# Altium schematic sheet 09 - Controlled Power.SchDoc: Controlled Power - 25kW WolfPACK 6-pack Inverter
size 431 x 279 mm; Date: 09/2024; DocumentNumber: CRD25DA12N-FMC; Revision: 2.0; SheetNumber: 9; SheetTotal: 9; SheetSize: B
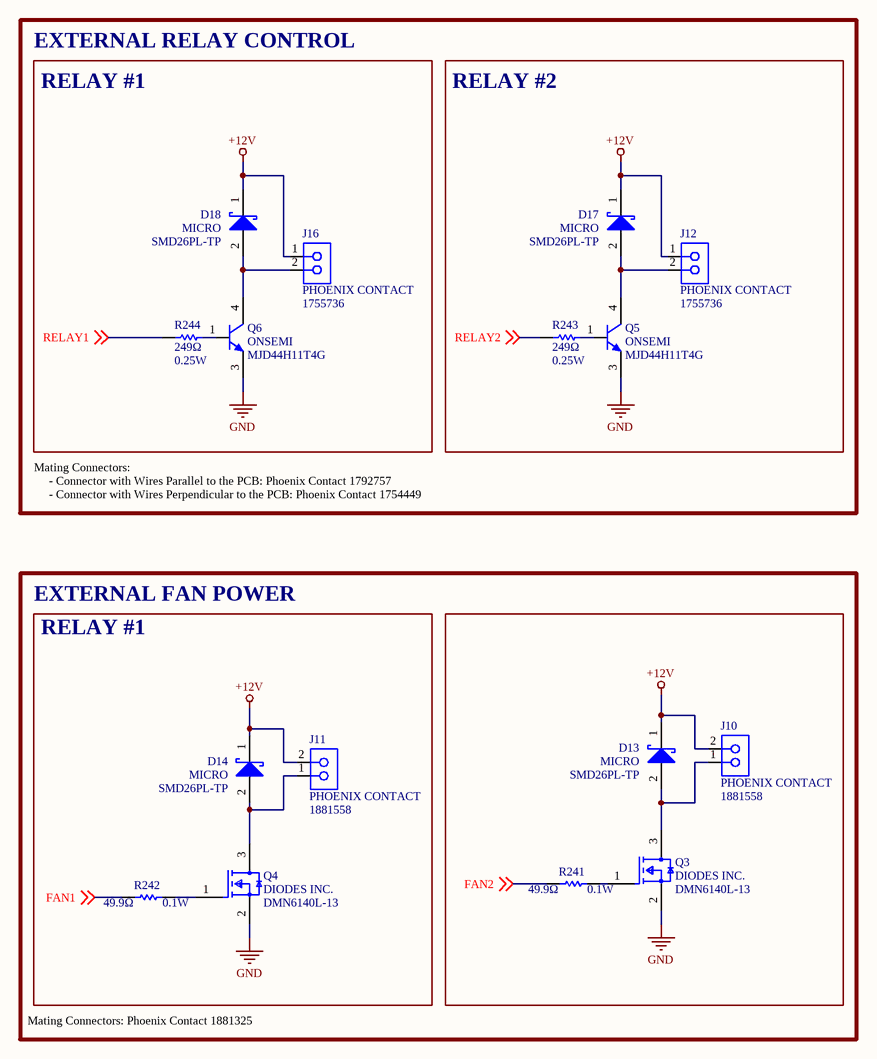
[diagram p0: 09 - Controlled Power.SchDoc]

## Parts
D13  SMD26PL-TP  Manufacturer: MICRO  [ONSC-SOD-123FL-2-498-01_V]
D14  SMD26PL-TP  Manufacturer: MICRO  [ONSC-SOD-123FL-2-498-01_V]
D17  SMD26PL-TP  Manufacturer: MICRO  [ONSC-SOD-123FL-2-498-01_V]
D18  SMD26PL-TP  Manufacturer: MICRO  [ONSC-SOD-123FL-2-498-01_V]
J10  Manufacturer: PHOENIX CONTACT  [CONN_1881558]  (hidden comment: 1881558)
J11  Manufacturer: PHOENIX CONTACT  [CONN_1881558]  (hidden comment: 1881558)
J12  Manufacturer: PHOENIX CONTACT  [1755736]  (hidden comment: 1755736)
J16  Manufacturer: PHOENIX CONTACT  [1755736]  (hidden comment: 1755736)
Q3  DMN6140L-13  Manufacturer: DIODES INC.  [FP-SOT23-MFG]
Q4  DMN6140L-13  Manufacturer: DIODES INC.  [FP-SOT23-MFG]
Q5  Manufacturer: ONSEMI  [ONSC-DPAK-3-369C-01_V]  (hidden comment: MJD44H11T4G)
Q6  Manufacturer: ONSEMI  [ONSC-DPAK-3-369C-01_V]  (hidden comment: MJD44H11T4G)
R241  Resistance: 49.9Ω  Power Rating: 0.1W  [FP-MCR03-IPC_B]  (hidden comment: ERJ-3EKF49R9V)
R242  Resistance: 49.9Ω  Power Rating: 0.1W  [FP-MCR03-IPC_B]  (hidden comment: ERJ-3EKF49R9V)
R243  Resistance: 249Ω  Power Rating: 0.25W  [FP-MCR18-IPC_A]  (hidden comment: RC1206FR-07249RL)
R244  Resistance: 249Ω  Power Rating: 0.25W  [FP-MCR18-IPC_A]  (hidden comment: RC1206FR-07249RL)

## Blocks framed on the sheet
RELAY #2: D17 J12 Q5 R243

## Nets
+12V: D13.1(K) D14.1(K) D17.1(K) D18.1(K) J10.2 J11.2 J12.1 J16.1
GND: Q3.2(S) Q4.2(S) Q5.3(E) Q6.3(E)
FAN1: R242.1 ; off-sheet FAN1
FAN2: R241.1 ; off-sheet FAN2
RELAY1: R244.1 ; off-sheet RELAY1
RELAY2: R243.1 ; off-sheet RELAY2
NetD13_2: D13.2(A) J10.1 Q3.3(D)
NetD14_2: D14.2(A) J11.1 Q4.3(D)
NetD17_2: D17.2(A) J12.2 Q5.4(C)
NetD18_2: D18.2(A) J16.2 Q6.4(C)
NetQ3_1: Q3.1(G) R241.2
NetQ4_1: Q4.1(G) R242.2
NetQ5_1: Q5.1(B) R243.2
NetQ6_1: Q6.1(B) R244.2

## Notes on the sheet
- EXTERNAL RELAY CONTROL
- RELAY #1
- Mating Connectors:
  - Connector with Wires Parallel to the PCB: Phoenix Contact 1792757
  - Connector with Wires Perpendicular to the PCB: Phoenix Contact 1754449
- EXTERNAL FAN POWER
- Mating Connectors: Phoenix Contact 1881325
- Title:
- Date:
- Drawing No:
- Size:
- B
- Revision:
- Sheet:
- of

## Library data of the parts
D13 D14 D17 D18 = SMD26PL-TP: DIODE SCHOTTKY 60V 2A SOD123FL; Forward Voltage: 700mV; Max Reverse Current: 500uA; Max Surge Current: 50A; Max Power Dissipation: 1.68W; Supplier 1: Digi-Key; Manufacturer Part Number: SMD26PL-TP; RoHS: Yes; Category: Rectifier Diodes; Stock 1: 317348; Pricing 1: 1=0.40000, 10=0.30200, 100=0.18790, 500=0.12854, 1000=0.09888 (USD); Mount: Surface Mount; Number of Pins: 2; Min Operating Temperature: -65°C; Max Operating Temperature: 125°C; Packaging: Tape and Reel; Package Quantity: 1; Average Rectified Current: 2A; Max Repetitive Reverse Voltage (Vrrm): 60V; Max Reverse Voltage (DC): 60V; Lead Free: Lead Free; RoHS Compliant: Yes; ComponentLink1URL: https://datasheet.ciiva.com/4717/smd22pl-smd210plsod-123fl-27814-4717414.pdf?src-supplier=Mouser; ComponentLink1Description: https://datasheet.ciiva.com/4717/smd22pl-smd210plsod-123fl-27814-4717414.pdf?src-supplier=Mouser; ComponentLink2URL: https://datasheet.ciiva.com/17444/smd22pl-smd210plsod-123fl-17444944.pdf?src-supplier=Future+Electronics; ComponentLink2Description: https://datasheet.ciiva.com/17444/smd22pl-smd210plsod-123fl-17444944.pdf?src-supplier=Future+Electronics; ComponentLink3URL: https://datasheet.ciiva.com/917/smd22pl-smd210plsod-123fl-917242.pdf?src-supplier=Digi-Key; ComponentLink3Description: https://datasheet.ciiva.com/917/smd22pl-smd210plsod-123fl-917242.pdf?src-supplier=Digi-Key; ComponentLink4URL: https://datasheet.ciiva.com/917/smd22pl-smd210plsod-123fl-917243.pdf?src-supplier=Digi-Key; ComponentLink4Description: https://datasheet.ciiva.com/917/smd22pl-smd210plsod-123fl-917243.pdf?src-supplier=Digi-Key; ComponentLink5URL: https://datasheet.ciiva.com/917/smd22pl-smd210plsod-123fl-917244.pdf?src-supplier=Digi-Key; ComponentLink5Description: https://datasheet.ciiva.com/917/smd22pl-smd210plsod-123fl-917244.pdf?src-supplier=Digi-Key; Supplier Part Number 1: SMD26PL-TPMSCT-ND; Package: SOD-123F; Value: N/A
J10 J11 = 1881558: TERM BLOCK HDR 2POS VERT 2.5MM; Manufacturer Part Number: 1881558; Package: N/A; Value: N/A
J12 J16 = 1755736: TERM BLOCK HDR 2POS VERT 5.08MM; Content: 250pc(s); Industrial packaging: Yes; Number of contacts: 2; Manufacturer URL: http://www.phoenixcontact.com/; Datasheet Version: Apr-16; Pitch: 5.08mm; Datasheet URL: http://www.mouser.com/ds/2/324/ItemDetail_1755736-921028.pdf; Manufacturer Part Number: 1755736; Type: MSTBVA2,5/2-G-5,08; Colour: Green; Supplier 1: Rs; Supplier Part Number 1: 1896199; Value: N/A; Package: N/A
Q3 Q4 = CMP-12801-000047-1: MOSFET N-CH 60V 1.6A SOT23; Turn Off Delay Time: 16.3ns; Power Dissipation: 0.7W; Pulse Drain Current: 10A; Number Of Channels: 1; Reverse Recovery Time: 16.8ns; Typ Forward Diode Voltage: 0.75V; Gate To Source Voltage: 20V; Rthja Max: 183°C/W; Gate Charge At Vgs: 8.6nC @ 10V; Drain To Source Resistance: 92mΩ; Depletion Mode: False; Max Junction Temp: +150°C; Max Forward Diode Voltage: 1V; Reverse Recovery Charge: 9nC; Input Capacitace At Vds: 315pF @ 40V; Standoff Height: 0.013mm; Threshold Vgs Max: 3V; Turn On Delay Time: 2.6ns; Mouser Description: MOSFET 31V to 99V N-Ch FET 60Vds 20Vgs 2.3A; ComponentLink2Description: Datasheet; Digikey Description: MOSFET N-CH 60V 1.6A SOT23; Lead Free: Yes; Category: Trans; Device Class L3: MOSFETs; Temperature Range High: +150°C; Octopart: https://octopart.com/dmn6140l-13-diodes+inc.-38898616; Drain To Source Voltage: 60V; ComponentLink2URL: https://www.diodes.com/assets/Datasheets/DMN6140L.pdf; Drain To Source Breakdown Voltage: 60V; Footprint Url: https://www.diodes.com/assets/Package-Files/SOT23.pdf; Package: SOT23; Continuous Drain Current: 1.6A; Device Class L1: Discrete Semiconductors; Device Class L2: Transistors; Number Of N Channels: 1; Temperature Range Low: -55°C; Height: 1.1mm; Manufacturer Part Number: DMN6140L-13; RoHS: TRUE; Temperature: -55°C to +150°C; Threshold Vgs Min: 1V; Automotive: No; Value: N/A
Q5 Q6 = CMP-1046-00010-1: TRANS NPN 80V 8A DPAK; IC Continuous (A): 8; Packing: Tape and Reel; PackageVersion: Rev. E, 02/2014; Polarity: NPN; ComponentLink2Description: Datasheet; ComponentLink2URL: http://www.onsemi.cn/pub_link/Collateral/MJD44H11-D.PDF; ComponentLink1URL: http://www.onsemi.com/; PackageReference: DPAK-3-369C-01; Mounting Technology: Surface Mount; ComponentLink1Description: Manufacturer URL; ComponentLink3URL: http://www.onsemi.cn/pub_link/Collateral/369C.PDF; ComponentLink3Description: Package Specification; PartNumber: MJD44H11T4G; PackageDescription: 3-Pin Flange Mount, Body 6.54 x 6.095 mm, Pitch 2.29 mm; DatasheetVersion: Rev. 16; RoHS: TRUE; Value: N/A; Manufacturer Part Number: MJD44H11T4G; Package: TO-252-3
R241 R242 = ERJ-3EKF49R9V: RES SMD 49.9 OHM 1% 1/10W 0603; Manufacturer: PANASONIC; Temperature Coefficient: 100ppm/°C; Voltage Rating: 75V; Max Power Dissipation: 100mW; Voltage Rating (DC): 50V; Working Voltage: 6V; Value: 49.9Ω; Supplier 1: Newark; Manufacturer Part Number: ERJ-3EKF49R9V; RoHS: Yes; Category: Chip SMD Resistors; Stock 1: 670000; Pricing 1: 1=0.00600, 5000=0.00600 (USD); Mount: Surface Mount; Contact Plating: Tin; Case Code (Imperial): 0603; Case Code (Metric): 1608; Min Operating Temperature: -55°C; Max Operating Temperature: 155°C; Tolerance: 1%; Resistor Type: Thick Film; Packaging: Tape and Reel; Package Quantity: 5000; Number of Terminations: 2; Termination: SMD/SMT; Features: Automotive AEC-Q200; Series: ERJ; Resistance Tolerance: 1%; Construction: Rectangular; Technology: THICK FILM; Length: 1.6mm; Width: 0.8mm; Height: 0.022inch; Depth: 0.8mm; Radiation Hardening: No; Reach SVHC Compliant: Yes; Military Standard: Not; Lead Free: Lead Free; RoHS Compliant: Yes; ComponentLink1URL: https://datasheet.ciiva.com/46388/1678782-46388908.pdf?src-supplier=Element14; ComponentLink1Description: https://datasheet.ciiva.com/46388/1678782-46388908.pdf?src-supplier=Element14; ComponentLink2URL: https://datasheet.ciiva.com/28694/1678782-28694219.pdf?src-supplier=Element14; ComponentLink2Description: https://datasheet.ciiva.com/28694/1678782-28694219.pdf?src-supplier=Element14; ComponentLink3URL: https://datasheet.ciiva.com/16772/70260748-16772570.pdf?src-supplier=Allied+Electronics; ComponentLink3Description: https://datasheet.ciiva.com/16772/70260748-16772570.pdf?src-supplier=Allied+Electronics; ComponentLink4URL: https://datasheet.ciiva.com/16766/70260748-16766262.pdf?src-supplier=Allied+Electronics; ComponentLink4Description: https://datasheet.ciiva.com/16766/70260748-16766262.pdf?src-supplier=Allied+Electronics; ComponentLink5URL: https://datasheet.ciiva.com/9117/aoa0000ce2-9117128.pdf?src-supplier=Avnet; ComponentLink5Description: https://datasheet.ciiva.com/9117/aoa0000ce2-9117128.pdf?src-supplier=Avnet; ComponentLink6URL: https://datasheet.ciiva.com/48531/aoa0000ce2-48531019.pdf?src-supplier=Avnet; ComponentLink6Description: https://datasheet.ciiva.com/48531/aoa0000ce2-48531019.pdf?src-supplier=Avnet; ComponentLink7URL: https://datasheet.ciiva.com/30095/aoa0000ce2-30095355.pdf?src-supplier=Onlinecomponents.com; ComponentLink7Description: https://datasheet.ciiva.com/30095/aoa0000ce2-30095355.pdf?src-supplier=Onlinecomponents.com; Supplier Part Number 1: 12AC1058; Package: 0603
R243 R244 = RC1206FR-07249RL: RES 249 OHM 1% 1/4W 1206; Manufacturer: YAGEO; Voltage Rating: 200V; Temperature Coefficient: 100ppm/°C; Max Power Dissipation: 250mW; Value: 249Ω; Supplier 1: Future Electronics; Manufacturer Part Number: RC1206FR-07249RL; RoHS: Yes; Category: Chip SMD Resistors; Stock 1: 560000; Pricing 1: 5000=0.00430, 25000=0.00410, 100000=0.00390, 250000=0.00370, 625000=0.00350 (USD); Package: 1206; Case Code (Imperial): 1206; Case Code (Metric): 3216; Size Code: 1206; Min Operating Temperature: -55°C; Max Operating Temperature: 155°C; Tolerance: 1%; Packaging: Tape and Reel; Termination: SMD/SMT; Resistor Type: Thick Film; Voltage Rating (DC): 200V; Features: Moisture Resistant; Series: RC; Number of Terminations: 2; Construction: Rectangular; Length: 3.1mm; Depth: 1.6mm; Military Standard: Not; Lead Free: Lead Free; RoHS Compliant: Yes; ComponentLink1URL: https://datasheet.ciiva.com/16747/pyu-rc1206-51-rohs-l-4-16747103.pdf?src-supplier=Future+Electronics; ComponentLink1Description: https://datasheet.ciiva.com/16747/pyu-rc1206-51-rohs-l-4-16747103.pdf?src-supplier=Future+Electronics; Supplier Part Number 1: 1142064